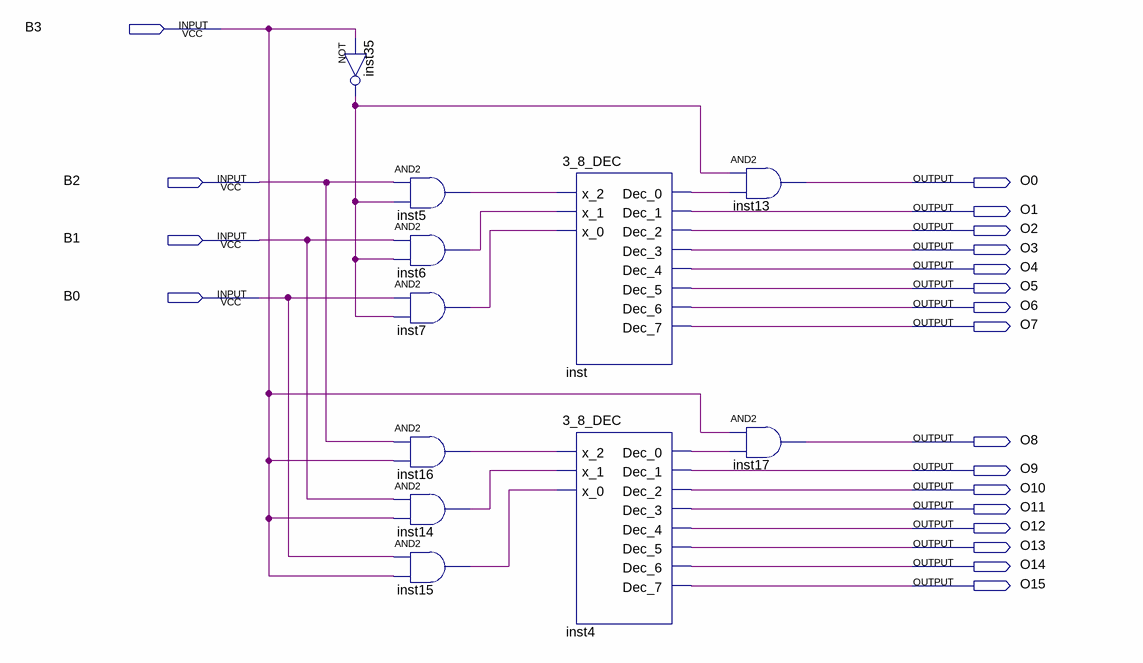
[diagram p0: schematic sheet]
// Quartus schematic 4_TO_16_DECODER.bdf as structural Verilog: 11 symbols, 20 pins
module \4_TO_16_DECODER  (
  input  B3,
  input  B2,
  input  B1,
  input  B0,
  output O0,
  output O1,
  output O2,
  output O3,
  output O4,
  output O5,
  output O6,
  output O7,
  output O8,
  output O9,
  output O10,
  output O11,
  output O12,
  output O13,
  output O14,
  output O15
);

  wire inst4_dec_0, inst5_out, inst6_out, inst7_out, inst14_out, inst15_out, inst16_out, inst35_out,
       inst_dec_0;

  not inst35 (inst35_out, B3);
  and inst5 (inst5_out, B2, inst35_out);
  and inst6 (inst6_out, B1, inst35_out);
  and inst7 (inst7_out, B0, inst35_out);
  and inst16 (inst16_out, B2, B3);
  and inst14 (inst14_out, B1, B3);
  and inst15 (inst15_out, B0, B3);
  \3_8_DEC  inst (
    .x_2(inst5_out), .x_1(inst6_out), .x_0(inst7_out), .Dec_0(inst_dec_0), .Dec_1(O1), .Dec_2(O2),
    .Dec_3(O3), .Dec_4(O4), .Dec_5(O5), .Dec_6(O6), .Dec_7(O7));
  \3_8_DEC  inst4 (
    .x_2(inst16_out), .x_1(inst14_out), .x_0(inst15_out), .Dec_0(inst4_dec_0), .Dec_1(O9), .Dec_2(O10),
    .Dec_3(O11), .Dec_4(O12), .Dec_5(O13), .Dec_6(O14), .Dec_7(O15));
  and inst13 (O0, inst35_out, inst_dec_0);
  and inst17 (O8, B3, inst4_dec_0);
endmodule
